# EAGLE design 12v-switch (EAGLE 6.5.0)
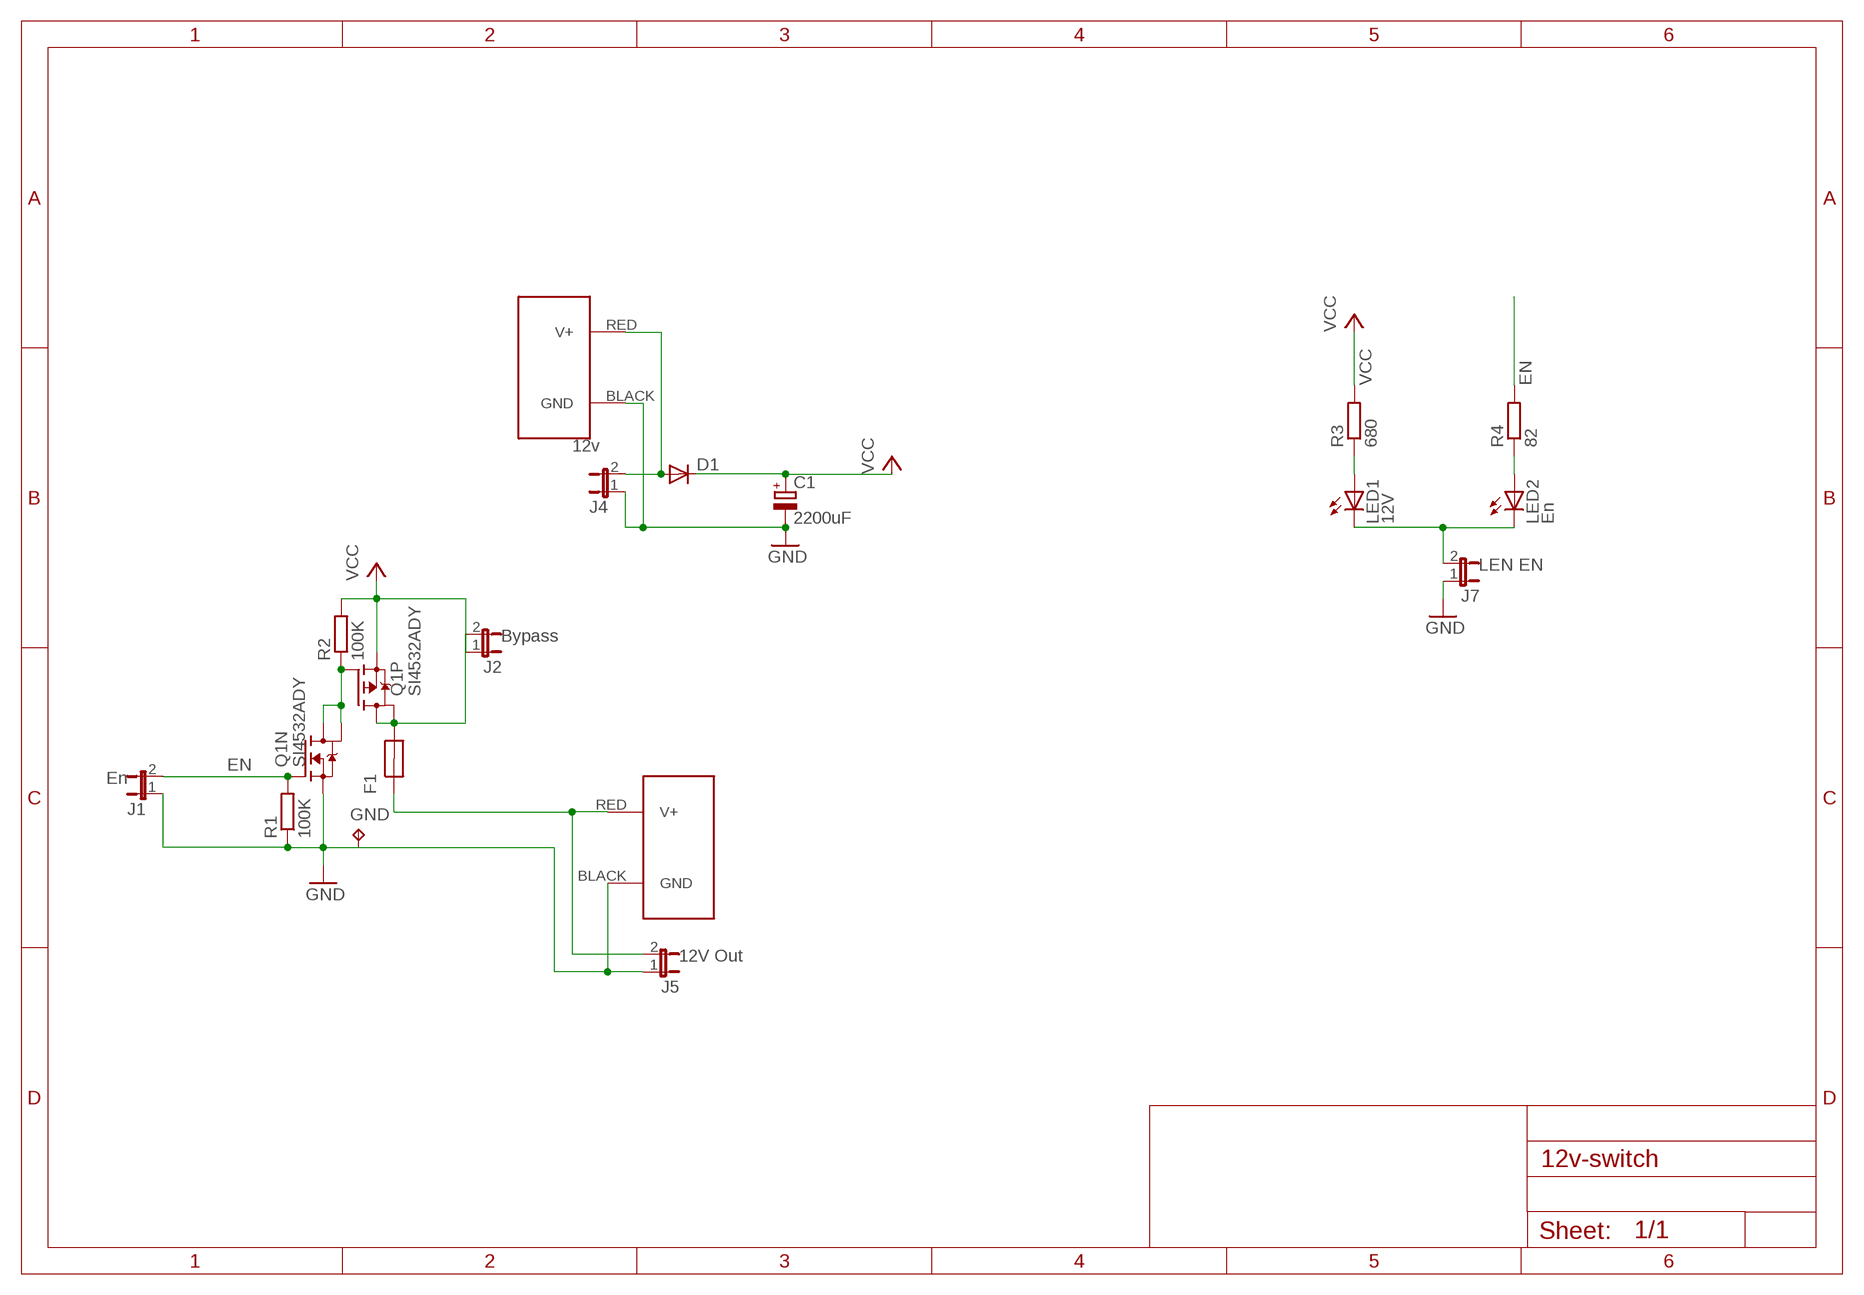
[diagram p0: schematic, sheet 1]

## Parts
C1  2200uF  CPOL-EUE5-13  [E5-13]
D1  DIODE-SMB  [SMB]
F1  MF-MSMF110  [1812]
GND  5V B  TPB1,27  [B1,27]
J1  En  2-PIN-MOLEX  [2-MOLEX]
J2  Bypass  2-PIN-MOLEX  [2-MOLEX]
J3  POWERPOLE_POWER25A  [POWERPOLE_PAIR_25A]
J4  12v  2-PIN-MOLEX  [2-MOLEX]
J5  12V Out  2-PIN-MOLEX  [2-MOLEX]
J6  POWERPOLE_POWER25A  [POWERPOLE_PAIR_25A]
J7  LEN EN  2-PIN-MOLEX  [2-MOLEX]
LED1  12V  LEDCHIP-LED0805  [CHIP-LED0805]
LED2  En  LEDCHIP-LED0805  [CHIP-LED0805]
Q1  SI4532ADY  [SO8]
R1  100K  R-EU_R0805  [R0805]
R2  100K  R-EU_R0805  [R0805]
R3  680  R-EU_R0805  [R0805]
R4  82  R-EU_R0805  [R0805]

## Nets
12V-SWITCHED: F1.1 J5.2 J6.RED(V+)
EN: J1.2 Q1.2(N:G) R1.2 R4.2
GND: C1.- GND.TP J1.1 J3.BLACK(GND) J4.1 J5.1 J6.BLACK(GND) J7.1 Q1.1(N:S) R1.1
LEDGND: J7.2 LED1.C LED2.C
N$1: D1.A J3.RED(V+) J4.2
N$2: LED1.A R3.1
N$25: Q1.4(P:G) Q1.7(N:D) Q1.8(N:D) R2.1
N$74: LED2.A R4.1
N$95: F1.2 J2.2 Q1.5(P:D) Q1.6(P:D)
VCC: C1.+ D1.C J2.1 Q1.3(P:S) R2.2 R3.2

## Library data of the parts
C1 = rcl:CPOL-EU: POLARIZED CAPACITOR, European symbol
D1 = diode:DIODE-: DIODE
F1 = farnell-parts:MF-MSMF110
GND = testpad:TP: Test pad
J1 J2 J4 J5 J7 = farnell-parts:2-PIN-MOLEX
J3 J6 = powerpoles:POWERPOLE_POWER: Anderson Powerpole Power Connector using ameteur radio standard layout
LED1 LED2 = led:LED: LED OSRAM: - CHIPLED LG R971, LG N971, LY N971, LG Q971, LY Q971, LO R971, LY R971 LH N974, LH R974 LS Q976, LO Q976, LY Q976 LO Q996 - Hyper CHIPLED LW Q18S LB Q993, LB Q99A, LB R99A - SideLED LS A670, LO A670, LY A670, LG A670, LP A670 LB A673, LV A673, LT A673, LW A673 LH A674 LY A675 LS A676, LA A676, LO A676, LY A676, LW A676 LS A679, LY A679, LG A679 - Hyper Micro SIDELED® LS Y876, LA Y876, LO Y876, LY Y876 LT Y87S - SmartLED LW L88C, LW L88S LB L89C, LB L89S, LG L890 LS L89K, LO L89K, LY L89K LS L896, LA L896, LO L896, LY L896 - TOPLED LS T670, LO T670, LY T670, LG T670, LP T670 LSG T670, LSP T670, LSY T670, LOP T670, LYG T670 LG T671, LOG T671, LSG T671 LB T673, LV T673, LT T673, LW T673 LH T674 LS T676, LA T676, LO T676, LY T676, LB T676, LH T676, LSB T676, LW T676 LB T67C, LV T67C, LT T67C, LS T67K, LO T67K, LY T67K, LW E67C LS E67B, LA E67B, LO E67B, LY E67B, LB E67C, LV E67C, LT E67C LW T67C LS T679, LY T679, LG T679 LS T770, LO T770, LY T770, LG T770, LP T770 LB T773, LV T773, LT T773, LW T773 LH T774 LS E675, LA E675, LY E675, LS T675 LS T776, LA T776, LO T776, LY T776, LB T776 LHGB T686 LT T68C, LB T68C - Hyper Mini TOPLED® LB M676 - Mini TOPLED Santana® LG M470 LS M47K, LO M47K, LY M47K Source: http://www.osram.convergy.de LUXEON: - LUMILED® LXK2-PW12-R00, LXK2-PW12-S00, LXK2-PW14-U00, LXK2-PW14-V00 LXK2-PM12-R00, LXK2-PM12-S00, LXK2-PM14-U00 LXK2-PE12-Q00, LXK2-PE12-R00, LXK2-PE12-S00, LXK2-PE14-T00, LXK2-PE14-U00 LXK2-PB12-K00, LXK2-PB12-L00, LXK2-PB12-M00, LXK2-PB14-N00, LXK2-PB14-P00, LXK2-PB14-Q00 LXK2-PR12-L00, LXK2-PR12-M00, LXK2-PR14-Q00, LXK2-PR14-R00 LXK2-PD12-Q00, LXK2-PD12-R00, LXK2-PD12-S00 LXK2-PH12-R00, LXK2-PH12-S00 LXK2-PL12-P00, LXK2-PL12-Q00, LXK2-PL12-R00 Source: www.luxeon.com KINGBRIGHT: KA-3528ASYC Source: www.kingbright.com
Q1 = basestation:SI4532ADY: N and P MOSFETS
R1-R4 = resistor:R-EU_: RESISTOR, European symbol

## Board
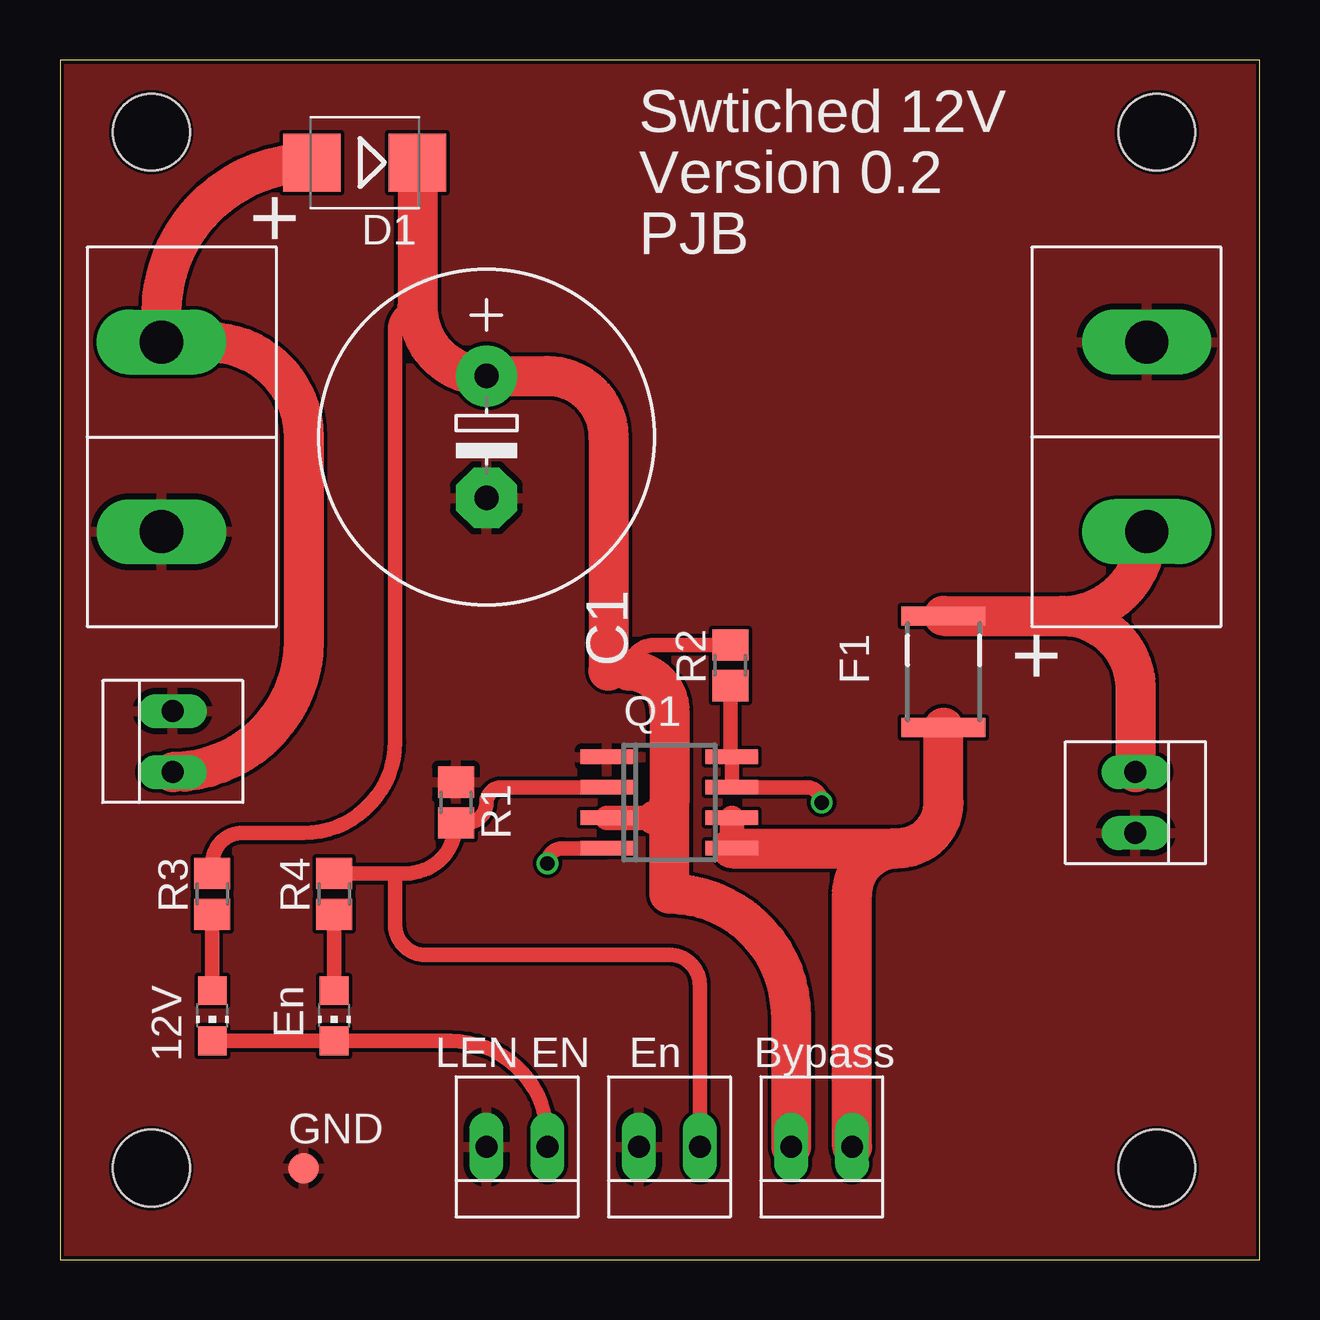
[diagram p1: board, top side]
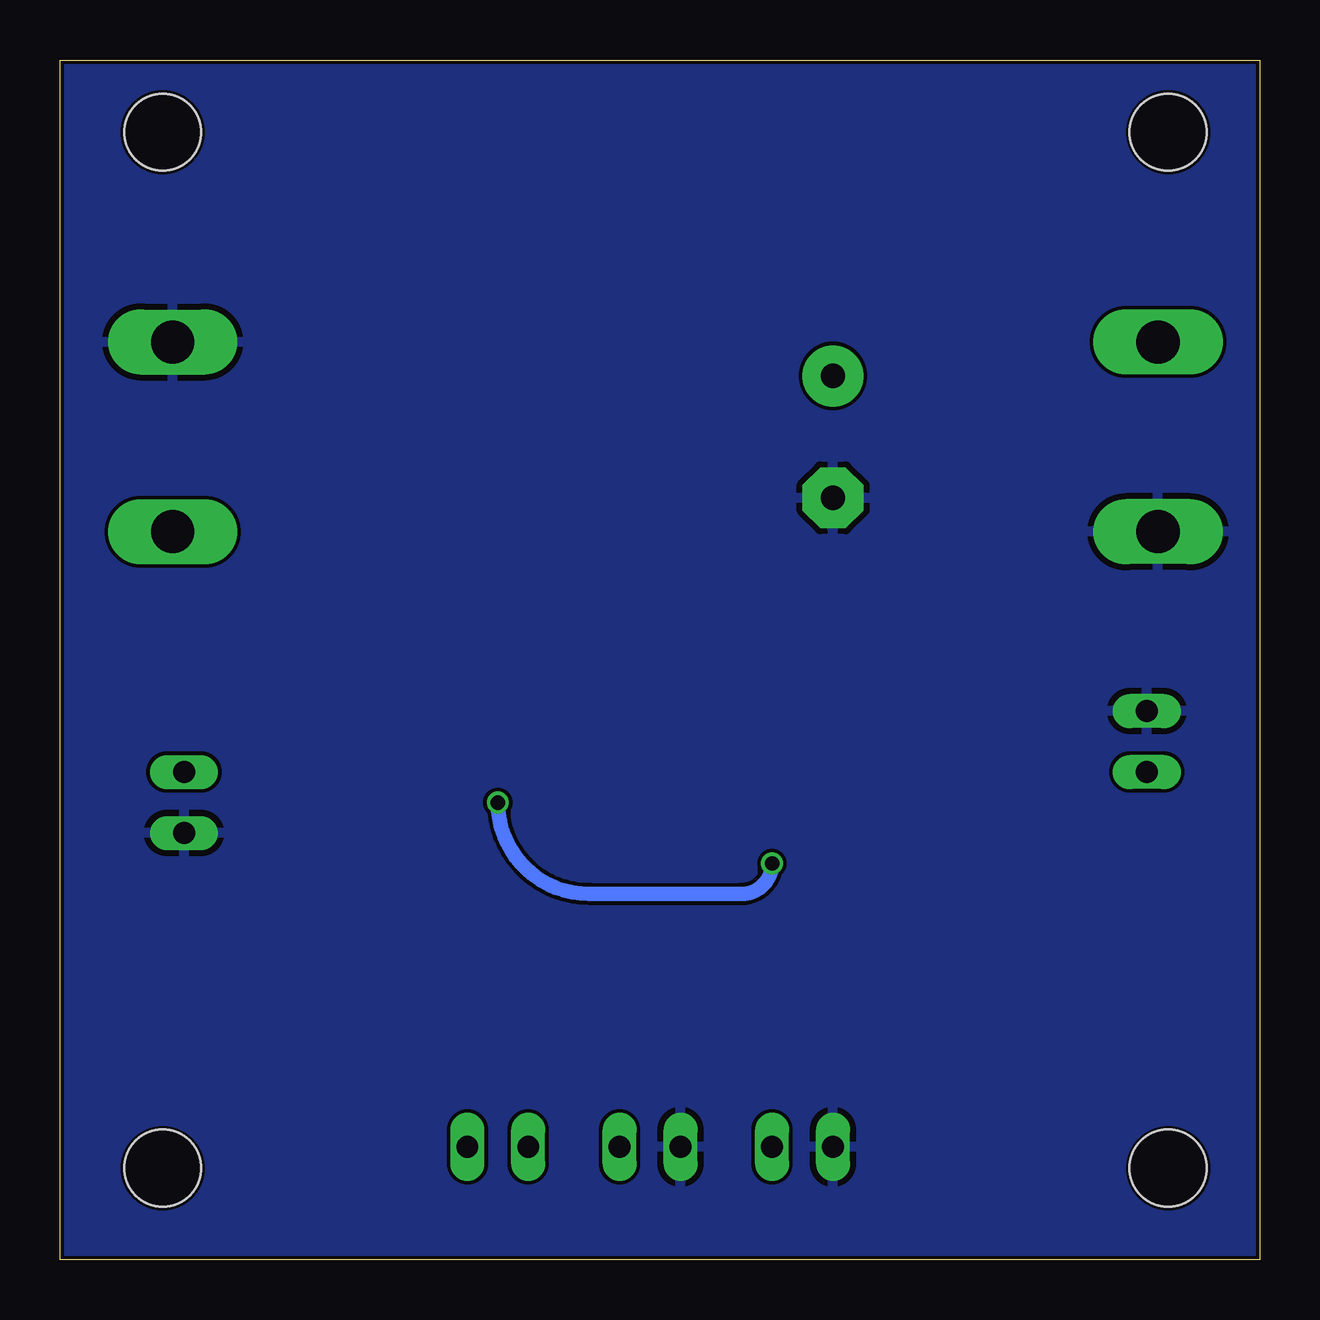
[diagram p2: board, bottom side, seen from below]

Size 50 x 50 mm. Coordinates in mm from the lower left corner, seen from the top.
Outline: 0,0 50,0 50,50 0,50 0,0
Copper layers (1*16): Top 0.035mm / dielectric 1.5mm / Bottom 0.035mm
Design rules "Hackvana *": minimum track width 6mil, minimum drill 0.3mm, track to track 6mil, track to pad 6mil, pad to pad 6mil, via to via 6mil, smd to smd 0mil, copper to edge 6mil, drill to drill 6mil, minimum pad ring 10mil, minimum via ring 6mil, stop-mask expansion 2mil, vias tented up to drill 100mil, thermal gap 10mil
Holes 3.2 mm at 3.81,46.99 45.72,46.99 45.72,3.81 3.81,3.81

### Footprints (pad centres in the part's own frame; a part is rotated, then mirrored left to right if it is on the bottom)
E5-13 = drill 1.016 pad 2.54: + -2.54,0 | drill 1.016 pad 2.54 octagon: - 2.54,0
SMB = smd 2.4 x 2.4: A 2.2,0; C -2.2,0
1812 = smd 0.8 x 3.5: 1 -1.425,0; 2 3.225,0
B1,27 = smd 1.27 x 1.27: TP 0,0
2-MOLEX = drill 0.914 long: 1 -1.27,-0.381; 2 1.27,-0.381
POWERPOLE_PAIR_25A = drill 1.8 long: BLACK 3.95,-0.85; RED -3.95,-0.85
CHIP-LED0805 = smd 1.2 x 1.2: A 0,-1.05; C 0,1.05
SO8 = smd 0.6 x 2.2: 1 -1.905,-2.6; 2 -0.635,-2.6; 3 0.635,-2.6; 4 1.905,-2.6; 5 1.905,2.6; 6 0.635,2.6; 7 -0.635,2.6; 8 -1.905,2.6
R0805 = smd 1.3 x 1.5: 1 -0.85,0; 2 0.85,0

### Placement (x,y rotation side)
C1  17.78,34.29 270 top
D1  12.7,45.72 180 top
F1  36.83,25.4 270 top
GND  10.16,3.81 0 top
J1  25.4,5.08 0 top
J2  31.75,5.08 0 top
J3  5.08,34.29 270 top
J4  5.08,21.59 270 top
J5  44.45,19.05 90 top
J6  44.45,34.29 90 top
J7  19.05,5.08 0 top
LED1  6.35,10.16 180 top
LED2  11.43,10.16 180 top
Q1  25.4,19.05 270 top
R1  16.51,19.05 270 top
R2  27.94,24.77 90 top
R3  6.35,15.24 90 top
R4  11.43,15.24 90 top

### Tracks (layer width: path | path; a pad name or v marks a point on that pad's centre or on a via)
12V-SWITCHED
  Top 1.676: F1.1 41.78,26.82 | 41.78,26.82 arc90 J6.RED | 41.78,26.82 arc-90 44.83,23.78 J5.2
EN
  Top 0.61: R4.2 13.97,16.09 | J1.2 26.67,11.43 arc90 25.4,12.7 15.24,12.7 arc-90 13.97,13.97 13.97,16.09 | 13.97,16.09 14.4,16.09 arc90 R1.2 16.93,18.2 arc90 17.78,19.05 arc-90 18.41,19.68 Q1.2
GND
  pour Top: -3.81,54.61 54.61,54.61 54.61,-3.81 -3.81,-3.81
  pour Bottom: -1.27,52.07 52.07,52.07 52.07,-2.54 -1.27,-2.54
LEDGND
  Top 0.61: LED1.C LED2.C 16.29,9.11 arc-90 20.32,5.08 J7.2
N$1
  Top 1.676: D1.A arc90 4.23,39.45 J3.RED 6.21,38.24 arc-90 10.16,34.29 10.16,25.78 arc-90 J4.2
N$2
  Top 0.61: LED1.A R3.1
N$25  (via drill 0.6)
  Top 0.61: R2.1 27.94,21.02 arc90 Q1.8 Q1.7 31.11,19.68 arc-90 v31.75,19.05 | v20.32,16.51 arc-90 20.95,17.14 Q1.4
  Bottom 0.61: v31.75,19.05 arc-90 27.94,15.24 21.59,15.24 arc-90 v20.32,16.51
N$74
  Top 0.61: R4.1 LED2.A
N$95
  Top 1.016: Q1.6 Q1.5
  Top 1.676: Q1.5 34.92,17.14 | 34.92,17.14 arc90 36.83,19.05 F1.2 | J2.2 33.02,15.24 arc-90 34.92,17.14
VCC
  Top 0.61: R3.2 6.35,16.51 arc-90 7.62,17.78 10.16,17.78 arc90 13.97,21.59 13.97,38.78 arc-90 14.9,39.71 | R2.2 24.77,25.61 arc90 23.71,24.55
  Top 1.016: 24.77,18.41 Q1.3
  Top 1.422: 22.86,24.55 23.71,24.55 | 25.4,19.05 arc-90 24.77,18.41
  Top 1.676: D1.C 14.9,39.71 arc90 C1.+ 20.32,36.83 arc-90 22.86,34.29 22.86,24.55 | 23.71,24.55 arc-90 25.4,22.86 25.4,19.05 25.4,15.24 arc-90 30.48,10.16 J2.1

### Text on the board
tNames: Swtiched 12V | Version 0.2 | PJB
Document: 2A Max